# Altium schematic sheet CurrentMeasure_PowerDistribution.SchDoc
size A; SheetNumber: 3; SheetTotal: 5
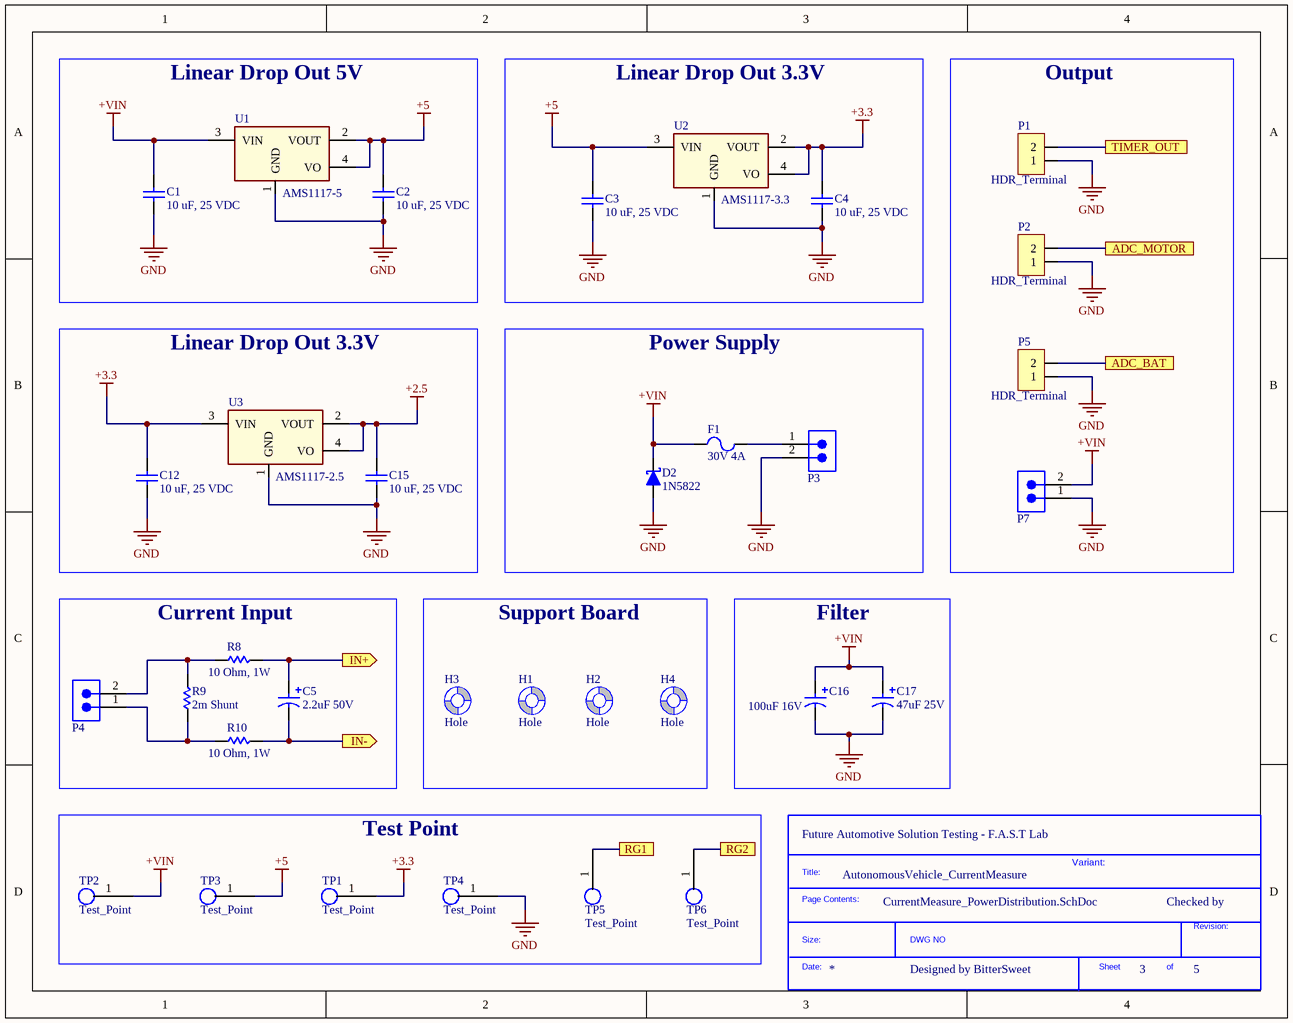
[diagram p0: CurrentMeasure_PowerDistribution.SchDoc]

## Parts
*?  SDTitleBlock  (value not drawn)  (graphical)
C1  10 uF, 25 VDC  [CAP_0805]
C2  10 uF, 25 VDC  [CAP_0805]
C3  10 uF, 25 VDC  [CAP_0805]
C4  10 uF, 25 VDC  [CAP_0805]
C5  2.2uF 50V  [CAP_4x7mm]
C12  10 uF, 25 VDC  [CAP_0805]
C15  10 uF, 25 VDC  [CAP_0805]
C16  100uF 16V  [CAP_4x7mm]
C17  47uF 25V  [CAP_4x7mm]
D2  1N5822  [DIODE_SCHOTTKY_DO-201AD]
F1  30V 4A  [FUSERUEF400]
H1  Hole  [Hole_3.2mm]
H2  Hole  [Hole_3.2mm]
H3  Hole  [Hole_3.2mm]
H4  Hole  [Hole_3.2mm]
P1  HDR_Terminal  [HDR_Header_2.54]
P2  HDR_Terminal  [HDR_Header_2.54]
P3  10A, 300V  [691322310002]  (value not drawn)
P4  10A, 300V  [691322310002]  (value not drawn)
P5  HDR_Terminal  [HDR_Header_2.54]
P7  10A, 300V  [691322310002]  (value not drawn)
R8  10 Ohm, 1W  [RESISTOR-1W]
R9  2m Shunt  [Shunt_Resistor]
R10  10 Ohm, 1W  [RESISTOR-1W]
TP1  Test_Point  [TP_1_5mm_SMD]
TP2  Test_Point  [TP_1_5mm_SMD]
TP3  Test_Point  [TP_1_5mm_SMD]
TP4  Test_Point  [TP_1_5mm_SMD]
TP5  Test_Point  [TP_1_5mm_SMD]
TP6  Test_Point  [TP_1_5mm_SMD]
U1  AMS1117-5  [AMS1117]
U2  AMS1117-3.3  [AMS1117]
U3  AMS1117-2.5  [AMS1117]

## Blocks framed on the sheet
Linear Drop Out 5V: C1 C2 U1
Linear Drop Out 3.3V: C3 C4 U2
Output: P1 P2 P5 P7
Linear Drop Out 3.3V: C12 C15 U3
Power Supply: D2 F1 P3
Current Input: C5 P4 R8-R10
Support Board: H1-H4
Filter: C16 C17
Test Point: TP1-TP6

## Ports
ADC_BAT, ADC_MOTOR, IN+ (out), IN- (out), RG1, RG2, TIMER_OUT

## Nets
+2.5: C15.2 U3.2(VOUT) U3.4(VO)
+3.3: C4.2 C12.2 TP1.1 U2.2(VOUT) U2.4(VO) U3.3(VIN)
+5: C2.2 C3.2 TP3.1 U1.2(VOUT) U1.4(VO) U2.3(VIN)
+VIN: C1.2 C16.2 C17.2 D2.2(K) F1.2 P7.2 TP2.1 U1.3(VIN)
GND: C1.1 C2.1 C3.1 C4.1 C12.1 C15.1 C16.1 C17.1 D2.1(A) P1.1 P2.1 P3.2 P5.1 P7.1 TP4.1 U1.1(GND) U2.1(GND) U3.1(GND)
ADC_BAT: P5.2 ; port ADC_BAT
ADC_MOTOR: P2.2 ; port ADC_MOTOR
IN+: C5.2 R8.2 ; port IN+
IN-: C5.1 R10.2 ; port IN-
RG1: TP5.1 ; port RG1
RG2: TP6.1 ; port RG2
TIMER_OUT: P1.2 ; port TIMER_OUT
NetF1_1: F1.1 P3.1
NetP4_1: P4.1 R9.1 R10.1
NetP4_2: P4.2 R8.1 R9.2

Not connected (* = marked no-connect by the designer): H1 1(Screw); H2 1(Screw); H3 1(Screw); H4 1(Screw)

## Notes on the sheet
- (near *?) Future Automotive Solution Testing - F.A.S.T Lab
- AutonomousVehicle_CurrentMeasure
- Variant:
- Checked by
- Designed by BitterSweet
- (in symbol SDTitleBlock) Title:; Page Contents:; Revision:; Size:; DWG NO; Date:; Sheet; of

## Library data of the parts
C1-C4 C12 C15 = 0108051061025: CAP, size 0805, 10 uF, 25 VDC; Manufacture Name: TDK; Manufacture SN: CGA4J1X7S1E106K125AE; Capacitance: 10 uF; Tolerance: +/-10%; Voltage Rating DC: 25 VDC; ComponentLink2Description: Datasheet; ComponentLink2URL: https://product.tdk.com/system/files/dam/doc/product/capacitor/ceramic/mlcc/catalog/mlcc_automotive_soft_en.pdf?ref_disty=mouser; Operating Temperature: -55 to +125degC; Packaging: Tape and Reel; Mounting Technology: SMT; Size: 0805; Supplier 1 Name: Mouser; Supplier 1 SN: 810-CGA4J1X7S1E106K2; Supplier 1 URL: https://www.mouser.vn/ProductDetail/TDK/CGA4J1X7S1E106K125AE?qs=PqoDHHvF64%252BJvhmUzM2odA%3D%3D&utm_source=mouser-refine-download&utm_medium=file&utm_campaign=CGA4J1X7S1E106K125AE&utm_content=TDK; Supplier 2 Name: Digi-Key; Supplier 2 SN: 445-181411-2-ND; Supplier 2 URL: https://www.digikey.com/en/products/detail/tdk-corporation/cga4j1x7s1e106k125ae/9744777; Supplier 3 Name: thegioiic; Supplier 3 SN: OEM; Supplier 3 URL: https://www.thegioiic.com/tu-gom-0603-10uf-25v; Value: 10 uF, 25 VDC
C5 = CAPCITOR_POLE: Capacitor D4xL7 2.2uF 50V; URL: https://www.thegioiic.com/tu-hoa-2-2uf-50v-4x7mm-xuyen-lo
C16 = CAPCITOR_POLE: Capacitor D4xL7 100uF 16V; URL: https://www.thegioiic.com/tu-hoa-100uf-16v-5x11mm-xuyen-lo
C17 = CAPCITOR_POLE: Capacitor D4xL7 47uF 25V; URL: https://www.thegioiic.com/tu-hoa-47uf-25v-5x11mm-xuyen-lo
D2 = Diode_Schottky: SS54 SMC Diode Schottky 5A 40V; URL: https://www.thegioiic.com/1n5822-diode-schottky-40v-3a-do-201ad
F1 = Fuse: JLCPCB Part: *; URL: https://www.thegioiic.com/ruef400-cau-chi-tu-phuc-hoi-30v-4a
P1 P2 P5 = HDR_Terminal: HDR_Terminal 2 pin; Supplier: ThegioiIC; ComponentLink1Description: URL; ComponentLink1URL: https://www.thegioiic.com/kf128-2-v-domino-2-chan-thang-3-5mm-300v-10a-han-pcb
P3 P4 P7 = 691322310002: WR-TBL Series 322 Horizontal PCB Header, THT, pitch 3.81mm, 2p; Manufacturer: Wurth Elektronik; Modularity: No; ComponentLink1Description: Datasheet Link; ComponentLink1URL: https://www.we-online.com/redexpert/spec/691322310002?ad; ComponentLink2Description: Supplier 1 URL; ComponentLink2URL: N/A; Manufacturer Part Number: 691322310002; Category: Terminal Blocks; Match Code: WR-TBL; Mount: Through Hole; Operating Temperature Max: 105°C; Operating Temperature Min: -40°C; Packaging: Box; Application: Pluggable; Number of Pins: 2; Number of Rows: 1; Orientation: Horizontal; Pitch: 3.81mm; Rated Current: 10A; Working Voltage: 300V; ComponentLink3Description: Supplier 2 URL; ComponentLink3URL: N/A; ComponentLink4Description: Supplier 3 URL; ComponentLink4URL: https://www.thegioiic.com/kf-3-81-2-r-terminal-block-plug-in-han-pcb-2-chan-cong-3-81mm-300v-10a; Supplier 1 Name: Mouser; Supplier 1 SN: N/A; Supplier 1 URL: N/A; Supplier 2 Name: Digi-Key; Supplier 2 SN: N/A; Supplier 2 URL: N/A; Supplier 3 Name: thegioiic; Supplier 3 SN: N/A; Supplier 3 URL: https://www.thegioiic.com/kf-3-81-2-r-terminal-block-plug-in-han-pcb-2-chan-cong-3-81mm-300v-10a; Value: 10A, 300V
R8 R10 = RESISTOR: Resistor 10 Ohm 1W 1%; MP: NUCLEO-F401RE; Availability: Unavailable; Price: None; Package: None; Value: *; URL: https://www.thegioiic.com/dien-tro-10-ohm-1w-1-5-vong-mau
R9 = RESISTOR: Resistor 2m Ohm Shunt; MP: NUCLEO-F401RE; Availability: Unavailable; Price: None; Package: None; Value: *; ComponentLink1Description: URL; ComponentLink1URL: https://icdayroi.com/dien-tro-shunt-0-002r-2mr
U1-U3 = AMS1117: IC Linear Drop Out 3.3V 1A SOT-223
  U1: URL: https://www.thegioiic.com/xblw-ams1117-5-0v-ic-on-ap-5v-1a-sot-223
  U2: URL: https://www.thegioiic.com/ams1117-3-3v-ic-on-ap-3-3v-1a-sot-223
  U3: URL: https://www.thegioiic.com/ams1117-2-5v-ic-on-ap-2-5v-1a-sot-223